# EAGLE design Mbus (EAGLE 9.6.2)
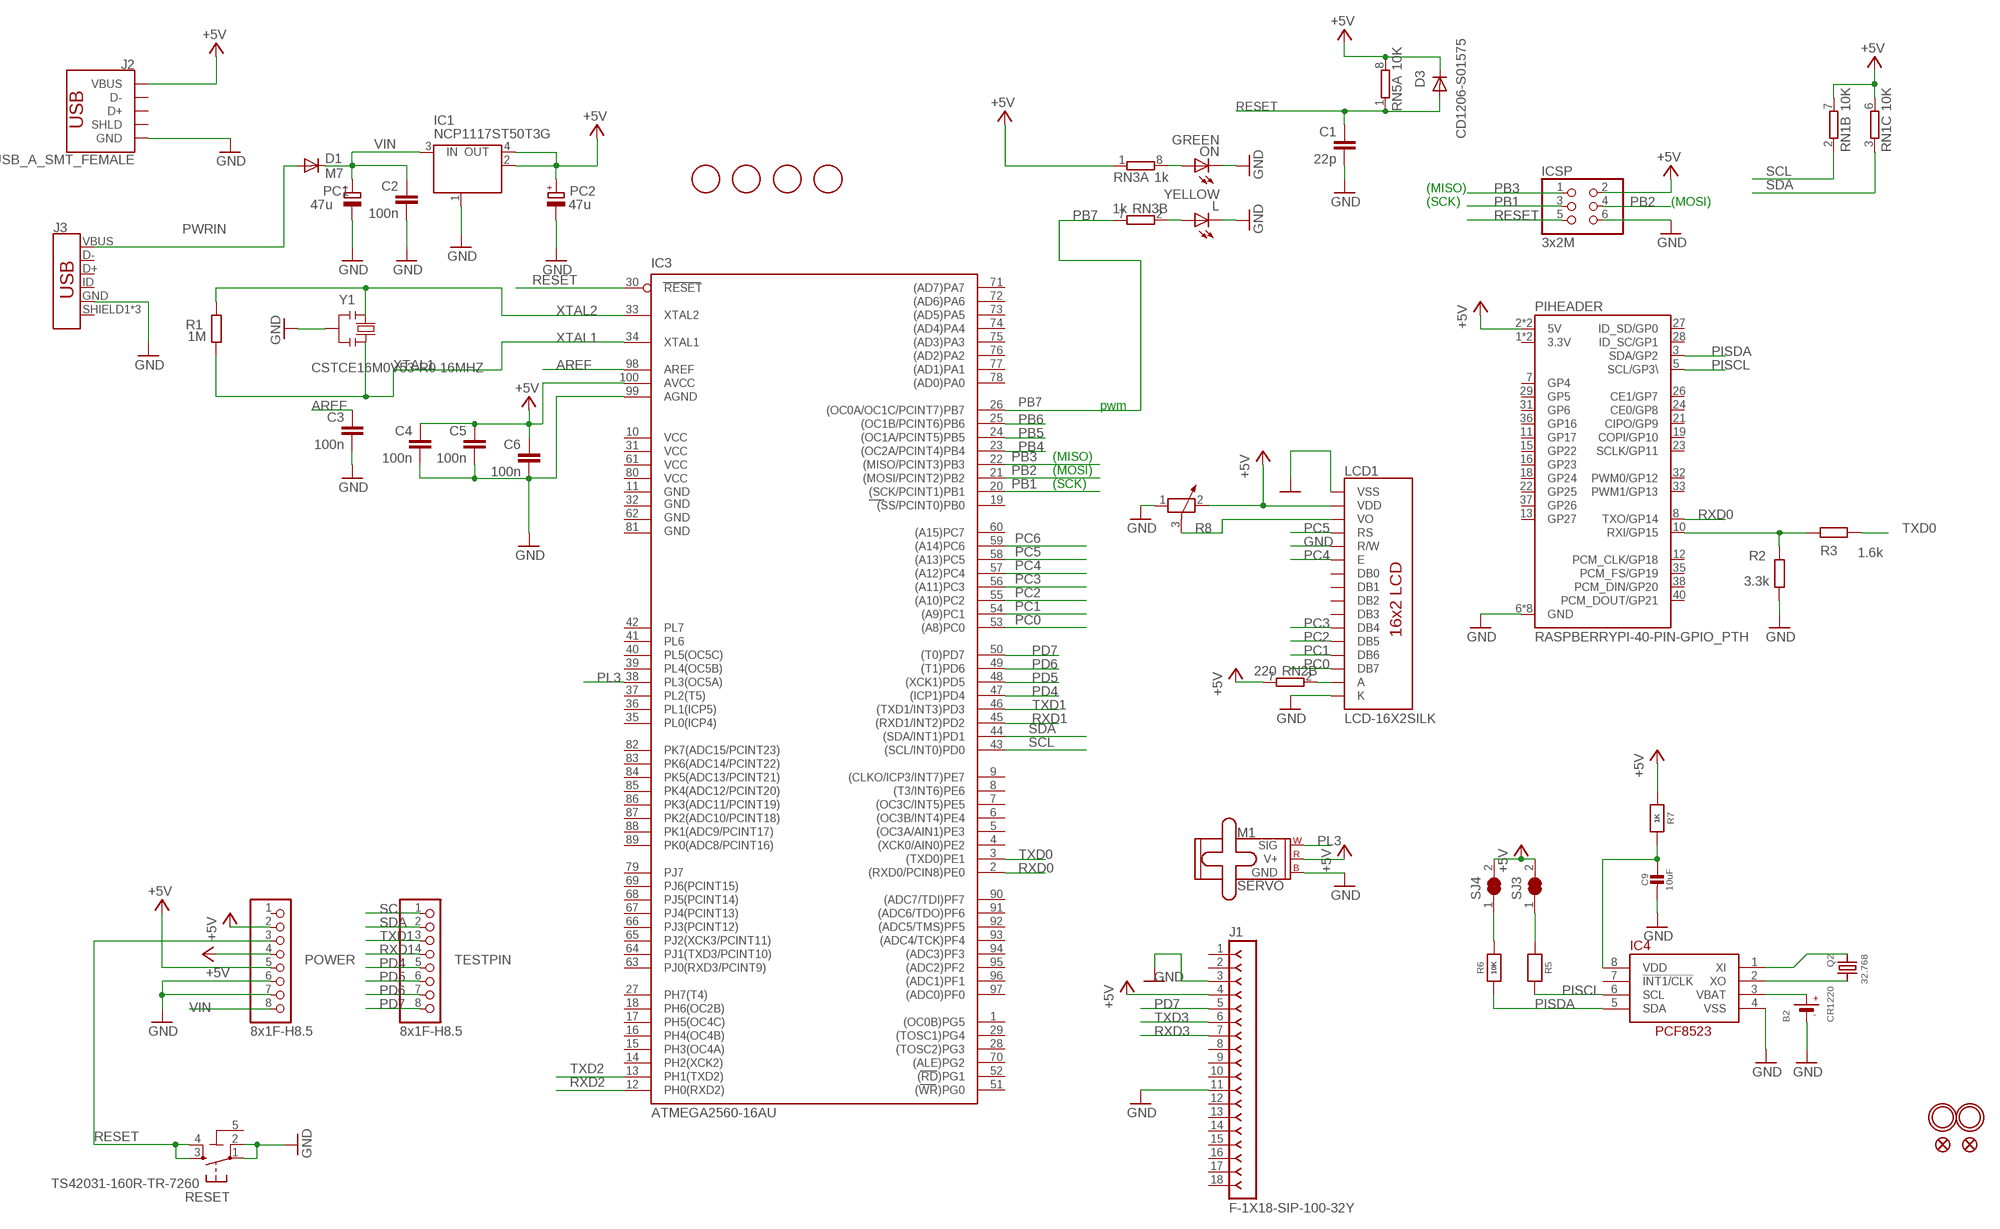
[diagram p0: schematic, sheet 1]

## Parts
B2  CR1220  BATTERYCR1220_SMT  [CR1220]
C1  22p  C-EU0603-RND  [C0603-ROUND]
C2  100n  C-EU0603-RND  [C0603-ROUND]
C3  100n  C-EU0603-RND  [C0603-ROUND]
C4  100n  C-EU0603-RND  [C0603-ROUND]
C5  100n  C-EU0603-RND  [C0603-ROUND]
C6  100n  C-EU0603-RND  [C0603-ROUND]
C9  10uF  CAP_CERAMIC0805-NOOUTLINE  [0805-NO]
D1  M7  DIODE-SMB  [SMB]
D3  CD1206-S01575  DIODE-MINIMELF  [MINIMELF]
FD1  FIDUCIALMOUNT  [FIDUCIA-MOUNT]
FD2  FIDUCIALMOUNT  [FIDUCIA-MOUNT]
FD3  FIDUCIALMOUNT  [FIDUCIA-MOUNT]
FD4  FIDUCIALMOUNT  [FIDUCIA-MOUNT]
FID3  FIDUCIAL""  [FIDUCIAL_1MM]
FID4  FIDUCIAL""  [FIDUCIAL_1MM]
IC1  NCP1117ST50T3G  MC33269ST-3.3T3  [SOT223]
IC3  ATMEGA2560-16AU  ATMEGA25602560-16AU  [TQFP100]
IC4  RTC_PCF8523T  [SOIC8_150MIL]
ICSP  3x2M  PINHD-2X3  [2X03]
J1  F-1X18-SIP-100-32Y  [SIP-100-18-32Y]
J2  USB_A_SMT_FEMALE  [USB-A-S-SILK-FEMALE]
J3  USB_MICRO-B_FEMALE-SMT  [USB-B-MICRO-SMD]
L  YELLOW  LEDCHIP-LED0805  [CHIP-LED0805]
LCD1  LCD-16X2SILK  [LCD-16X2]
M1  SERVO  [1X03]
ON  GREEN  LEDCHIP-LED0805  [CHIP-LED0805]
PC1  47u  CPOL-EUD  [PANASONIC_D]
PC2  47u  CPOL-EUD  [PANASONIC_D]
PIHEADER  RASPBERRYPI-40-PIN-GPIO_PTH  [2X20_SHROUDED]
POWER  8x1F-H8.5  PINHD-1X8  [1X08]
Q2  32.768  CRYSTAL8.0X3.8  [CRYSTAL_8X3.8]
R1  1M  R-EU_R0603  [R0603-ROUND]
R2  3.3k  R-EU_R0603  [R0603-ROUND]
R3  1.6k  R-EU_R0603  [R0603-ROUND]
R5  10K  RESISTOR0805_NOOUTLINE  [0805-NO]
R6  10K  RESISTOR0805_NOOUTLINE  [0805-NO]
R7  1K  RESISTOR0805_NOOUTLINE  [0805-NO]
R8  POTENTIOMETER_PT-10  [PT-10]
RESET  TS42031-160R-TR-7260  TS42  [TS42]
RN1  10K  4R-NCAT16  [CAT16]
RN2  220  4R-NCAY16  [CAY16]
RN3  1k  4R-NCAY16  [CAY16]
RN5  10K  4R-NCAT16  [CAT16]
SJ3  SOLDERJUMPER_CLOSED  [SOLDERJUMPER_CLOSEDWIRE]
SJ4  SOLDERJUMPER_CLOSED  [SOLDERJUMPER_CLOSEDWIRE]
TESTPIN  8x1F-H8.5  PINHD-1X8  [1X08]
U$2  MOUNTINGHOLE2.0  [MOUNTINGHOLE_2.0_PLATED]
U$3  MOUNTINGHOLE2.0  [MOUNTINGHOLE_2.0_PLATED]
Y1  CSTCE16M0V53-R0 16MHZ  RESONATORMU  [RESONATOR]

## Nets
+5V [power usb]: C4.1 C5.1 C6.1 D3.C IC1.2(OUT) IC1.4(OUT) IC3.100(AVCC) ICSP.2 J1.4 J2.VBUS LCD1.2(VDD) M1.2(V+) PC2.+ PIHEADER.2(5V) PIHEADER.4(5V) POWER.2 POWER.4 POWER.5 R7.1 R8.2 RN1.6 RN1.7 RN2.7 RN3.1 RN5.8 SJ3.2 SJ4.2
AREF: C3.1 IC3.98(AREF)
GND [gnd]: B2.- C1.2 C2.2 C3.2 C4.2 C5.2 C6.2 C9.2 IC1.1(GND/ADJ) IC3.99(AGND) IC4.4(VSS) ICSP.6 J1.3 J1.11 J2.GND J3.GND L.C LCD1.1(VSS) LCD1.5(R/W) LCD1.16(K) M1.3(GND) ON.C PC1.- PC2.- PIHEADER.6(GND) PIHEADER.9(GND) PIHEADER.14(GND) PIHEADER.20(GND) PIHEADER.25(GND) PIHEADER.30(GND) PIHEADER.34(GND) PIHEADER.39(GND) POWER.6 POWER.7 R2.1 R8.1 RESET.1 RESET.2 Y1.2
N$2: L.A RN3.2
N$3: ON.A RN3.8
N$6: IC4.1(XI) Q2.P$1
N$7: IC4.2(XO) Q2.P$4
N$8: R5.1 SJ3.1
N$9: R6.2 SJ4.1
N$10: C9.1 IC4.8(VDD) R7.2
N$11: LCD1.15(A) RN2.2
N$22: LCD1.3(VO) R8.3
PB1: IC3.20((SCK/PCINT1)PB1) ICSP.3
PB2: IC3.21((MOSI/PCINT2)PB2) ICSP.4
PB3: IC3.22((MISO/PCINT3)PB3) ICSP.1
PB4: IC3.23((OC2A/PCINT4)PB4)
PB5: IC3.24((OC1A/PCINT5)PB5)
PB6: IC3.25((OC1B/PCINT6)PB6)
PB7: IC3.26((OC0A/OC1C/PCINT7)PB7) RN3.7
PC0: IC3.53((A8)PC0) LCD1.14(DB7)
PC1: IC3.54((A9)PC1) LCD1.13(DB6)
PC2: IC3.55((A10)PC2) LCD1.12(DB5)
PC3: IC3.56((A11)PC3) LCD1.11(DB4)
PC4: IC3.57((A12)PC4) LCD1.6(E)
PC5: IC3.58((A13)PC5) LCD1.4(RS)
PC6: IC3.59((A14)PC6)
PD4: IC3.47((ICP1)PD4) TESTPIN.5
PD5: IC3.48((XCK1)PD5) TESTPIN.6
PD6: IC3.49((T1)PD6) TESTPIN.7
PD7: IC3.50((T0)PD7) J1.5 TESTPIN.8
PISCL: IC4.6(SCL) PIHEADER.5(SCL/GP3\) R5.2
PISDA: IC4.5(SDA) PIHEADER.3(SDA/GP2) R6.1
PL3: IC3.38(PL3(OC5A)) M1.1(SIG)
PWRIN [power]: D1.A J3.VBUS
RESET: C1.1 D3.A IC3.30(RESET) ICSP.5 POWER.3 RESET.3 RESET.4 RN5.1
RXD0: IC3.2((RXD0/PCIN8)PE0) PIHEADER.8(TXO/GP14)
RXD1: IC3.45((RXD1/INT2)PD2) TESTPIN.4
RXD2: IC3.12(PH0(RXD2))
RXD3: J1.7
SCL: IC3.43((SCL/INT0)PD0) RN1.2 TESTPIN.1
SDA: IC3.44((SDA/INT1)PD1) RN1.3 TESTPIN.2
TXD0: IC3.3((TXD0)PE1) R3.1
TXD1: IC3.46((TXD1/INT3)PD3) TESTPIN.3
TXD2: IC3.13(PH1(TXD2)) PIHEADER.10(RXI/GP15) R2.2 R3.2
TXD3: J1.6
VBAT1: B2.+$1(+) IC4.3(VBAT)
VIN [power]: C2.1 D1.C IC1.3(IN) PC1.+ POWER.8
XTAL1: IC3.34(XTAL1) R1.1 Y1.3
XTAL2: IC3.33(XTAL2) R1.2 Y1.1
Unconnected: IC3.1((OC0B)PG5) IC3.4((XCK0/AIN0)PE2) IC3.5((OC3A/AIN1)PE3) IC3.6((OC3B/INT4)PE4) IC3.7((OC3C/INT5)PE5) IC3.8((T3/INT6)PE6) IC3.9((CLKO/ICP3/INT7)PE7) IC3.14(PH2(XCK2)) IC3.15(PH3(OC4A)) IC3.16(PH4(OC4B)) IC3.17(PH5(OC4C)) IC3.18(PH6(OC2B)) IC3.19((SS/PCINT0)PB0) IC3.27(PH7(T4)) IC3.28((TOSC2)PG3) IC3.29((TOSC1)PG4) IC3.35(PL0(ICP4)) IC3.36(PL1(ICP5)) IC3.37(PL2(T5)) IC3.39(PL4(OC5B)) IC3.40(PL5(OC5C)) IC3.41(PL6) IC3.42(PL7) IC3.51((WR)PG0) IC3.52((RD)PG1) IC3.60((A15)PC7) IC3.63(PJ0(RXD3/PCINT9)) IC3.64(PJ1(TXD3/PCINT10)) IC3.65(PJ2(XCK3/PCINT11)) IC3.66(PJ3(PCINT12)) IC3.67(PJ4(PCINT13)) IC3.68(PJ5(PCINT14)) IC3.69(PJ6(PCINT15)) IC3.70((ALE)PG2) IC3.71((AD7)PA7) IC3.72((AD6)PA6) IC3.73((AD5)PA5) IC3.74((AD4)PA4) IC3.75((AD3)PA3) IC3.76((AD2)PA2) IC3.77((AD1)PA1) IC3.78((AD0)PA0) IC3.79(PJ7) IC3.82(PK7(ADC15/PCINT23)) IC3.83(PK6(ADC14/PCINT22)) IC3.84(PK5(ADC13/PCINT21)) IC3.85(PK4(ADC12/PCINT20)) IC3.86(PK3(ADC11/PCINT19)) IC3.87(PK2(ADC10/PCINT18)) IC3.88(PK1(ADC9/PCINT17)) IC3.89(PK0(ADC8/PCINT16)) IC3.90((ADC7/TDI)PF7) IC3.91((ADC6/TDO)PF6) IC3.92((ADC5/TMS)PF5) IC3.93((ADC4/TCK)PF4) IC3.94((ADC3)PF3) IC3.95((ADC2)PF2) IC3.96((ADC1)PF1) IC3.97((ADC0)PF0) IC4.7(!INT1/CLK) J1.1 J1.2 J1.8 J1.9 J1.10 J1.12 J1.13 J1.14 J1.15 J1.16 J1.17 J1.18 J2.D+ J2.D- J2.SHLD1(SHLD) J2.SHLD2(SHLD) J3.D+ J3.D- J3.ID J3.SHIELD1(SHIELD) J3.SHIELD2(SHIELD) J3.SHIELD3(SHIELD) LCD1.7(DB0) LCD1.8(DB1) LCD1.9(DB2) LCD1.10(DB3) PIHEADER.7(GP4) PIHEADER.11(GP17) PIHEADER.12(PCM_CLK/GP18) PIHEADER.13(GP27) PIHEADER.15(GP22) PIHEADER.16(GP23) PIHEADER.18(GP24) PIHEADER.19(COPI/GP10) PIHEADER.21(CIPO/GP9) PIHEADER.22(GP25) PIHEADER.23(SCLK/GP11) PIHEADER.24(CE0/GP8) PIHEADER.26(CE1/GP7) PIHEADER.27(ID_SD/GP0) PIHEADER.28(ID_SC/GP1) PIHEADER.29(GP5) PIHEADER.31(GP6) PIHEADER.32(PWM0/GP12) PIHEADER.33(PWM1/GP13) PIHEADER.35(PCM_FS/GP19) PIHEADER.36(GP16) PIHEADER.37(GP26) PIHEADER.38(PCM_DIN/GP20) PIHEADER.40(PCM_DOUT/GP21) POWER.1 RN1.1 RN1.4 RN1.5 RN1.8 RN2.1 RN2.3 RN2.4 RN2.5 RN2.6 RN2.8 RN3.3 RN3.4 RN3.5 RN3.6 RN5.2 RN5.3 RN5.4 RN5.5 RN5.6 RN5.7

## Notes on the sheet
- (MISO)
- (SCK) | (MOSI)
- pwm
- (MISO)
- (MOSI)
- (SCK)

## Power pins joined to a net without a drawn wire
3.3V: PIHEADER.1(3.3V) PIHEADER.17(3.3V)
5-GND: RESET.5(5-GND)
GND: IC3.11(GND)
GND1: IC3.32(GND1)
GND2: IC3.62(GND2)
GND3: IC3.81(GND3)
VCC: IC3.10(VCC)
VCC1: IC3.31(VCC1)
VCC2: IC3.61(VCC2)
VCC3: IC3.80(VCC3)

## Library data of the parts
B2 = microbuilder:BATTERY: CR1220 SMT - Digikey: 3001K-ND CD2032 BAT-HLD-001 - Digikey: BAT-HLD-001-ND
C1-C6 = SmartPrj:C-EU: CAPACITOR, European symbol
C9 = microbuilder:CAP_CERAMIC: Ceramic Capacitors For new designs, use the packages preceded by an '_' character since they are more reliable: The following footprints should be used on most boards: _0402 - Standard footprint for regular board layouts _0603 - Standard footprint for regular board layouts _0805 - Standard footprint for regular board layouts _1206 - Standard footprint for regular board layouts For extremely tight-pitch boards where space is at a premium, the following 'micro-pitch' footprints can be used (smaller pads, no silkscreen outline, etc.): _0402MP - Micro-pitch footprint for very dense/compact boards _0603MP - Micro-pitch footprint for very dense/compact boards _0805MP - Micro-pitch footprint for very dense/compact boards _1206MP - Micro-pitch footprint for very dense/compact boards
D1 D3 = diode:DIODE-: DIODE
FD1-FD4 = SmartPrj:FIDUCIALMOUNT
FID3 FID4 = microbuilder:FIDUCIAL: Fiducial Alignment Points Various fiducial points for machine vision alignment.; BOM: EXCLUDE
IC1 = linear:MC33269ST*: Adjustable Output Low Dropout Voltage Regulator 800 mA Source: http://www.onsemi.com/pub/Collateral/MC33269-D.PDF
IC3 = SmartPrj:ATMEGA2560: MICROCONTROLLER 64/128/256 Kbytes FLASH 4 Kbytes EEPROM 8 Kbytes SRAM 86 General Purpose I/O pins 12-channels16-bit PWM 4 x Serial USARTs 16-channels 10-bit A/D
IC4 = microbuilder:RTC_PCF8523
ICSP = SmartPrj:PINHD-2X3: PIN HEADER
J1 = con-headers-jp:F-1X18-: FEMALE HEADER
J2 = SparkFun-Connectors:USB_A: USB-A Connector Male and female variants, as well as PTH and SMT variants SparkFun Products: SparkFun XBee Explorer Dongle <https://www.sparkfun.com/products/11697> PTH Male SparkFun MicroView-USB Programmer <https://www.sparkfun.com/products/12924> SMT Male SparkFun USB Type A Female Breakout <https://www.sparkfun.com/products/12700> SMT Female; PROD_ID: CONN-09520; SF_ID: PRT-09011
J3 = SparkFun-Connectors:USB_MICRO-B: USB Type Micro-B Connector Male/female and PTH/SMT variants SparkFun Products: SparkFun microB USB Breakout <https://www.sparkfun.com/products/12035> SparkFun USB microB Plug Breakout <https://www.sparkfun.com/products/10031> SparkFun ESP8266 Thing <https://www.sparkfun.com/products/13231>; PROD_ID: CONN-11752
L ON = led:LED: LED OSRAM: - CHIPLED LG R971, LG N971, LY N971, LG Q971, LY Q971, LO R971, LY R971 LH N974, LH R974 LS Q976, LO Q976, LY Q976 LO Q996 - Hyper CHIPLED LW Q18S LB Q993, LB Q99A, LB R99A - SideLED LS A670, LO A670, LY A670, LG A670, LP A670 LB A673, LV A673, LT A673, LW A673 LH A674 LY A675 LS A676, LA A676, LO A676, LY A676, LW A676 LS A679, LY A679, LG A679 - Hyper Micro SIDELED® LS Y876, LA Y876, LO Y876, LY Y876 LT Y87S - SmartLED LW L88C, LW L88S LB L89C, LB L89S, LG L890 LS L89K, LO L89K, LY L89K LS L896, LA L896, LO L896, LY L896 - TOPLED LS T670, LO T670, LY T670, LG T670, LP T670 LSG T670, LSP T670, LSY T670, LOP T670, LYG T670 LG T671, LOG T671, LSG T671 LB T673, LV T673, LT T673, LW T673 LH T674 LS T676, LA T676, LO T676, LY T676, LB T676, LH T676, LSB T676, LW T676 LB T67C, LV T67C, LT T67C, LS T67K, LO T67K, LY T67K, LW E67C LS E67B, LA E67B, LO E67B, LY E67B, LB E67C, LV E67C, LT E67C LW T67C LS T679, LY T679, LG T679 LS T770, LO T770, LY T770, LG T770, LP T770 LB T773, LV T773, LT T773, LW T773 LH T774 LS E675, LA E675, LY E675, LS T675 LS T776, LA T776, LO T776, LY T776, LB T776 LHGB T686 LT T68C, LB T68C - Hyper Mini TOPLED® LB M676 - Mini TOPLED Santana® LG M470 LS M47K, LO M47K, LY M47K Source: http://www.osram.convergy.de LUXEON: - LUMILED® LXK2-PW12-R00, LXK2-PW12-S00, LXK2-PW14-U00, LXK2-PW14-V00 LXK2-PM12-R00, LXK2-PM12-S00, LXK2-PM14-U00 LXK2-PE12-Q00, LXK2-PE12-R00, LXK2-PE12-S00, LXK2-PE14-T00, LXK2-PE14-U00 LXK2-PB12-K00, LXK2-PB12-L00, LXK2-PB12-M00, LXK2-PB14-N00, LXK2-PB14-P00, LXK2-PB14-Q00 LXK2-PR12-L00, LXK2-PR12-M00, LXK2-PR14-Q00, LXK2-PR14-R00 LXK2-PD12-Q00, LXK2-PD12-R00, LXK2-PD12-S00 LXK2-PH12-R00, LXK2-PH12-S00 LXK2-PL12-P00, LXK2-PL12-Q00, LXK2-PL12-R00 Source: www.luxeon.com KINGBRIGHT: KA-3528ASYC Source: www.kingbright.com
LCD1 = SparkFun-Displays:LCD-16X2: Standard text-only 16x2 parallel input LCD Basic 16 character by 2 line display. Typically utilizes the extremely common HD44780 parallel interface chipset SparkFun Products: Basic 16x2 Green <https://www.sparkfun.com/products/255> Basic 8x2 Green <https://www.sparkfun.com/products/11122>; PROD_ID: LCD-12633; SF_ID: LCD-00255
M1 = SparkFun-Electromechanical:SERVO: Servo Motor 3-pin connector for a standard servo motor (voltage supply, ground, and control signal.) SparkFun Products Servo - Generic (Sub-Micro Size) <https://www.sparkfun.com/products/9065> (ROB-09065) Servo - Generic High Torque Continuous Rotation (Standard Size) <https://www.sparkfun.com/products/9347> (ROB-09347) Servo - Generic High Torque (Standard Size) <https://www.sparkfun.com/products/11965> (ROB-11965)
PC1 PC2 = rcl:CPOL-EU: POLARIZED CAPACITOR, European symbol
PIHEADER = SparkFun-Connectors:RASPBERRYPI-40-PIN-GPIO: Raspberry Pi GPIO Header 2x20 pin connector, as found on B, B+, A+ models. Both shrouded PTH and SMT versions available. SparkFun Products: GPIO Shrouded Header <https://www.sparkfun.com/products/13054>- PTH SparkFun Pi Wedge (Preassembled) <https://www.sparkfun.com/products/13717>; PROD_ID: CONN-12263; SF_ID: PRT-13054
POWER TESTPIN = SmartPrj:PINHD-1X8: PIN HEADER
Q2 = microbuilder:CRYSTAL: Crystals HC49UP - Surface Mount Crystal 4.0MHz 18pF +/-30ppm Surface Mount Crystal [Digikey: 535-9857-1-ND] 12.0 MHz Surface Mount Crystal [Digikey: 535-9869-6-ND] 25.0 MHz Surface Mount Crystal [Digikey: 535-9078-1-ND] 2.5 x 2.0mm - MEMs SMT Crystal 16.0 MHz 10pF 20ppm 2.5 x 2.0mm Crystal [Digikey -40-85°C: 535-10923-1-ND] 3.2 x 2.5mm - MEMs SMT Crystal 12.0 MHz 8pF 15ppm 3.2 x 2.5mm Crystal [Digikey: -10-70°C: 644-1047-1-ND -40-125°C: 644-1128-1-ND] 40~85°C cheaper: 644-1173-6-ND 16.0 MHz 8pF 15ppm 3.2 x 2.5mm Crystal [Digikey: -10-70°C: 644-1049-1-ND -40-125°C: 644-1129-2-ND]-40~85°C cheaper: 644-1175-6-ND 16.0 MHz 10pF 10ppm 3.2 x 2.5mm Crystal [Digikey: 644-1100-1-ND] 27.12 MHz 18pF 30ppm 3.2 x 2.5mm Crystal [Digikey: 887-1424-1-ND] 27.12MHz 10pF 10ppm 3.2 x 2.5mm Crystal [Digikey: 887-1329-1-ND] 4.9 x 1.8mm - MEMs SMT Crystal 32.768 KHz 12.5pF 20ppm 4.9 x 1.8mm Crystal [Digikey: SE2415CT-ND] 8.0 x 3.8mm - Surface Mount Crystal 32.768kHz 12.5pF 20ppm -40°C-85°C [Digikey: 535-9166-2-ND] Cylinder 32.768KHz Cylinder Crystal (2x6mm body) [Ex. Digikey: 300-8341-2-ND]
R1-R3 = SmartPrj:R-EU_: RESISTOR, European symbol
R5-R7 = microbuilder:RESISTOR: Resistors For new designs, use the packages preceded by an '_' character since they are more reliable: The following footprints should be used on most boards: _0402 - Standard footprint for regular board layouts _0603 - Standard footprint for regular board layouts _0805 - Standard footprint for regular board layouts _1206 - Standard footprint for regular board layouts For extremely tight-pitch boards where space is at a premium, the following 'micro-pitch' footprints can be used (smaller pads, no silkscreen outline, etc.): _0402MP - Micro-pitch footprint for very dense/compact boards _0603MP - Micro-pitch footprint for very dense/compact boards _0805MP - Micro-pitch footprint for very dense/compact boards _1206MP - Micro-pitch footprint for very dense/compact boards
R8 = rcl:POTENTIOMETER_: Potentiometer; SPICEMODEL: POT; SPICEPREFIX: X
RESET = SmartPrj:TS42: TS42 Dongnan Electronics Tact switch VDC 12V - 50mA
RN1-RN3 RN5 = resistor-dil:4R-N: Array Chip Resistor Source: RS Component / Phycomp
SJ3 SJ4 = microbuilder:SOLDERJUMPER_CLOSED: Solder Jumper - Closed These solder jumpers are closed by default CLOSEDWIRE - 10 mil trace between pads that can be cut and resoldered later CLOSEDPERM - 63 mil trace between pads for a permanent connection (used to 'bridge' two signals, a shameless hack for Eagle). Can double as a test point as well (no cream layer)
U$2 U$3 = microbuilder:MOUNTINGHOLE: Mounting Hole For #2 screws (0.086"/2.18mm width, 0.094"/2.4mm hole) use 2.5mm; BOM: EXCLUDE
Y1 = SmartPrj:RESONATOR

## Net classes
1 power: width 0.61 mm, drill 0.406 mm, clearance 0.203 mm
2 gnd: width 0.305 mm, drill 0.406 mm, clearance 0.203 mm
3 power usb: width 0.508 mm, drill 0.406 mm, clearance 0.203 mm

## Board
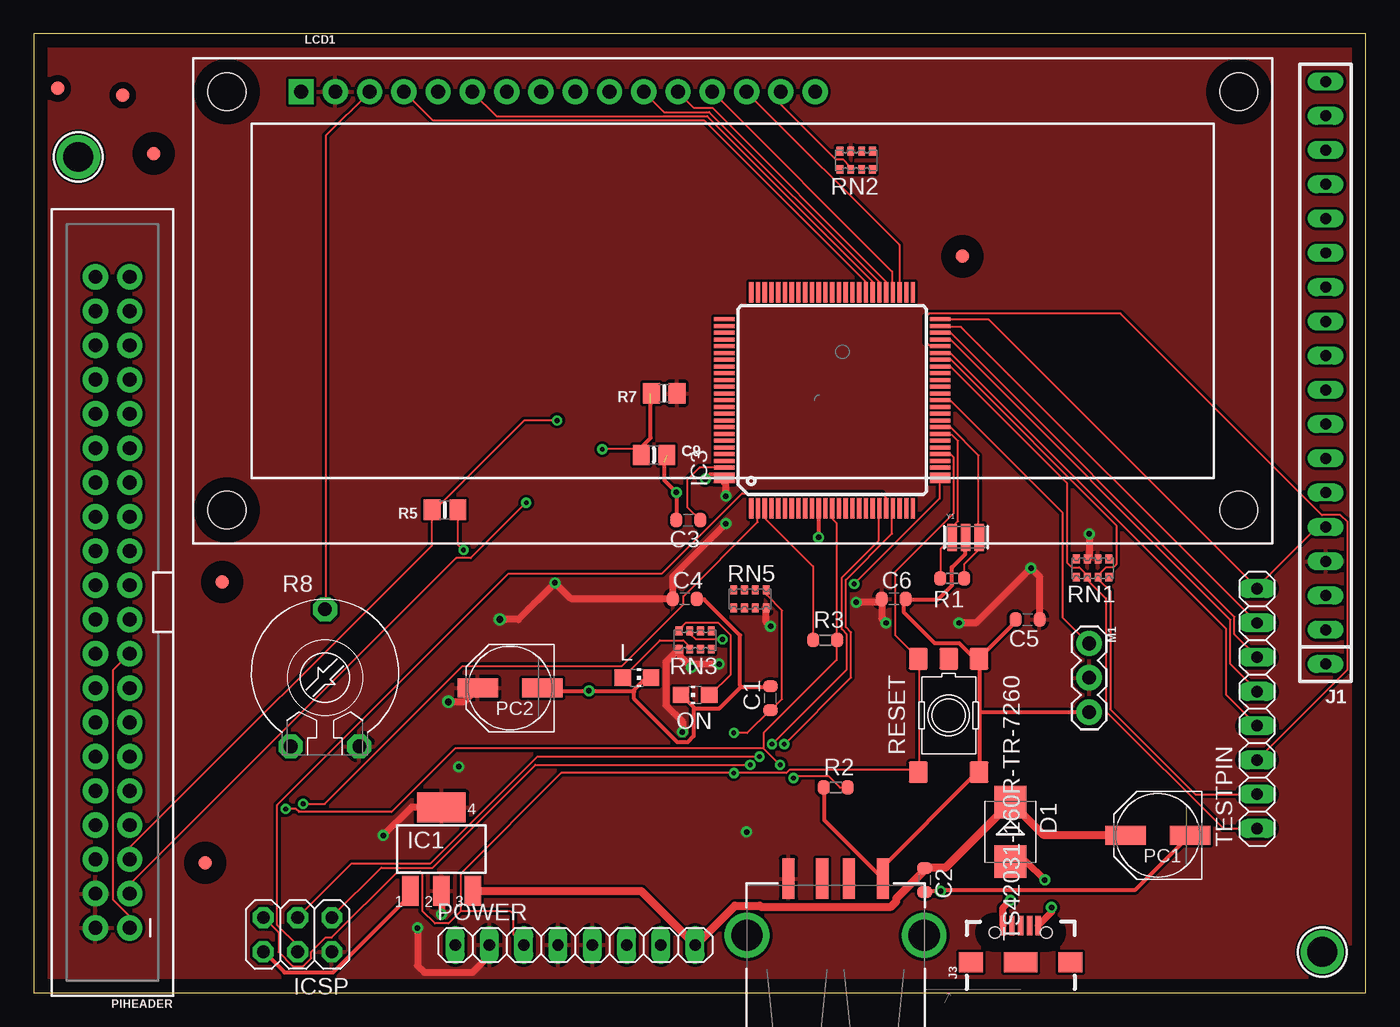
[diagram p1: board, top side]
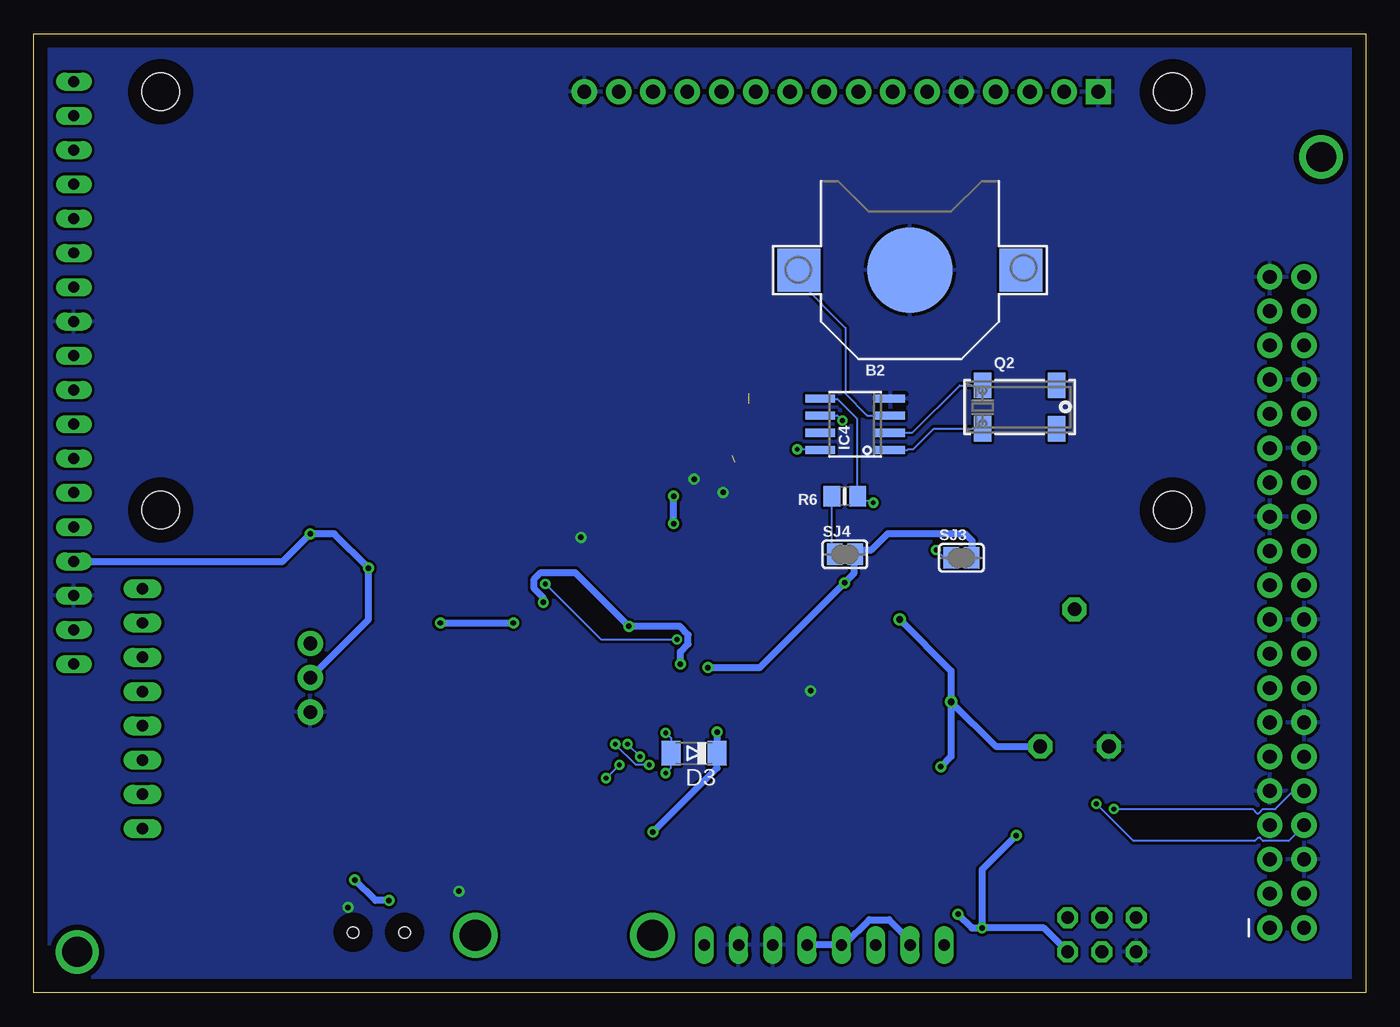
[diagram p2: board, bottom side, seen from below]

Size 98.73 x 71.11 mm. Coordinates in mm from the lower left corner, seen from the top.
Outline: 0,0 98.73,0 98.73,71.11 0,71.11 0,0
Copper layers (1*16): Top 0.035mm / dielectric 1.5mm / Bottom 0.035mm
Design rules "default *": minimum track width 6mil, minimum drill 0.35mm, track to track 0.002540625mm, track to pad 0.002540625mm, pad to pad 0.002540625mm, via to via 0.002540625mm, smd to smd 0.002540625mm, copper to edge 40mil, drill to drill 6mil, minimum pad ring 10mil, minimum via ring 8mil, stop-mask expansion 4mil, vias tented up to drill 0mil, thermal gap 10mil

### Footprints (pad centres in the part's own frame; a part is rotated, then mirrored left to right if it is on the bottom)
CR1220 = smd 3.2 x 3.2: +$1 -8.225,0; +$2 8.225,0 | smd 6.35 x 6.35: - 0,0
C0603-ROUND = smd 0.898 x 1.1: 1 -0.889,0; 2 0.889,0
0805-NO = smd 1.24 x 1.5: 1 -0.95,0; 2 0.95,0
SMB = smd 2.4 x 2.4: A 2.2,0; C -2.2,0
MINIMELF = smd 1.4 x 1.8: A 1.7,0; C -1.7,0
FIDUCIA-MOUNT = smd 1.016 x 1.016: P$1 0,0
FIDUCIAL_1MM = smd 1 x 1: 1 0,0
SOT223 = smd 1.219 x 2.235: 1 -2.311,-3.099; 2 0,-3.099; 3 2.311,-3.099 | smd 3.6 x 2.2: 4 0,3.099
TQFP100 = smd 1.5 x 0.3: 1 -8,6; 2 -8,5.5; 3 -8,5; 4 -8,4.5; 5 -8,4; 6 -8,3.5; 7 -8,3; 8 -8,2.5; 9 -8,2; 10 -8,1.5; 11 -8,1; 12 -8,0.5; 13 -8,0; 14 -8,-0.5; 15 -8,-1; 16 -8,-1.5; 17 -8,-2; 18 -8,-2.5; 19 -8,-3; 20 -8,-3.5; 21 -8,-4; 22 -8,-4.5; 23 -8,-5; 24 -8,-5.5; 25 -8,-6; 51 8,-6; 52 8,-5.5; 53 8,-5; 54 8,-4.5; 55 8,-4; 56 8,-3.5; 57 8,-3; 58 8,-2.5; 59 8,-2; 60 8,-1.5; 61 8,-1; 62 8,-0.5; 63 8,0; 64 8,0.5; 65 8,1; 66 8,1.5; 67 8,2; 68 8,2.5; 69 8,3; 70 8,3.5; 71 8,4; 72 8,4.5; 73 8,5; 74 8,5.5; 75 8,6 | smd 0.3 x 1.5: 26 -6,-8; 27 -5.5,-8; 28 -5,-8; 29 -4.5,-8; 30 -4,-8; 31 -3.5,-8; 32 -3,-8; 33 -2.5,-8; 34 -2,-8; 35 -1.5,-8; 36 -1,-8; 37 -0.5,-8; 38 0,-8; 39 0.5,-8; 40 1,-8; 41 1.5,-8; 42 2,-8; 43 2.5,-8; 44 3,-8; 45 3.5,-8; 46 4,-8; 47 4.5,-8; 48 5,-8; 49 5.5,-8; 50 6,-8; 76 6,8; 77 5.5,8; 78 5,8; 79 4.5,8; 80 4,8; 81 3.5,8; 82 3,8; 83 2.5,8; 84 2,8; 85 1.5,8; 86 1,8; 87 0.5,8; 88 0,8; 89 -0.5,8; 90 -1,8; 91 -1.5,8; 92 -2,8; 93 -2.5,8; 94 -3,8; 95 -3.5,8; 96 -4,8; 97 -4.5,8; 98 -5,8; 99 -5.5,8; 100 -6,8
SOIC8_150MIL = smd 0.6 x 2.2: 1 -1.905,-2.6; 2 -0.635,-2.6; 3 0.635,-2.6; 4 1.905,-2.6; 5 1.905,2.6; 6 0.635,2.6; 7 -0.635,2.6; 8 -1.905,2.6
2X03 = drill 0.95 pad 1.55 octagon: 1 -2.54,-1.27; 2 -2.54,1.27; 3 0,-1.27; 4 0,1.27; 5 2.54,-1.27; 6 2.54,1.27
SIP-100-18-32Y = drill 0.813 long: 1 -21.59,0; 2 -19.05,0; 3 -16.51,0; 4 -13.97,0; 5 -11.43,0; 6 -8.89,0; 7 -6.35,0; 8 -3.81,0; 9 -1.27,0; 10 1.27,0; 11 3.81,0; 12 6.35,0; 13 8.89,0; 14 11.43,0; 15 13.97,0; 16 16.51,0; 17 19.05,0; 18 21.59,0
USB-A-S-SILK-FEMALE = smd 3 x 0.9: D+ 7.212,-1; D- 7.212,1; GND 7.212,-3.5; VBUS 7.212,3.5 | drill 2.311: SHLD1 3,-6.566; SHLD2 3,6.566
USB-B-MICRO-SMD = smd 1.45 x 0.4: D+ 2.725,0; D- 2.725,0.65; GND 2.725,-1.3; ID 2.725,-0.65; VBUS 2.725,1.3 | smd 1.5 x 1.8: SHIELD1 0,3.685; SHIELD2 0,-3.685 | smd 1.5 x 2.5: SHIELD3 0,0 | hole 0.85: 2.2,1.9; 2.2,-1.9
CHIP-LED0805 = smd 1.2 x 1.2: A 0,-1.05; C 0,1.05
LCD-16X2 = drill 1.016 pad 1.88 square: 1 -32,15.5 | drill 1.016 pad 1.88: 2 -29.46,15.5; 3 -26.92,15.5; 4 -24.38,15.5; 5 -21.84,15.5; 6 -19.3,15.5; 7 -16.76,15.5; 8 -14.22,15.5; 9 -11.68,15.5; 10 -9.14,15.5; 11 -6.6,15.5; 12 -4.06,15.5; 13 -1.52,15.5; 14 1.02,15.5; 15 3.56,15.5; 16 6.1,15.5 | hole 2.8: -37.5,15.5; -37.5,-15.5; 37.5,15.5; 37.5,-15.5
1X03 = drill 1.016 pad 1.88: 1 0,0; 2 2.54,0; 3 5.08,0
PANASONIC_D = smd 3 x 1.4: + 2.4,0; - -2.4,0
2X20_SHROUDED = drill 1.016 pad 1.88: 1 -1.27,24.13; 2 1.27,24.13; 3 -1.27,21.59; 4 1.27,21.59; 5 -1.27,19.05; 6 1.27,19.05; 7 -1.27,16.51; 8 1.27,16.51; 9 -1.27,13.97; 10 1.27,13.97; 11 -1.27,11.43; 12 1.27,11.43; 13 -1.27,8.89; 14 1.27,8.89; 15 -1.27,6.35; 16 1.27,6.35; 17 -1.27,3.81; 18 1.27,3.81; 19 -1.27,1.27; 20 1.27,1.27; 21 -1.27,-1.27; 22 1.27,-1.27; 23 -1.27,-3.81; 24 1.27,-3.81; 25 -1.27,-6.35; 26 1.27,-6.35; 27 -1.27,-8.89; 28 1.27,-8.89; 29 -1.27,-11.43; 30 1.27,-11.43; 31 -1.27,-13.97; 32 1.27,-13.97; 33 -1.27,-16.51; 34 1.27,-16.51; 35 -1.27,-19.05; 36 1.27,-19.05; 37 -1.27,-21.59; 38 1.27,-21.59; 39 -1.27,-24.13; 40 1.27,-24.13
1X08 = drill 0.85 pad 1.422 long: 1 -8.89,0; 2 -6.35,0; 3 -3.81,0; 4 -1.27,0; 5 1.27,0; 6 3.81,0; 7 6.35,0; 8 8.89,0
CRYSTAL_8X3.8 = smd 1.3 x 1.9: P$1 -2.75,-1.6; P$2 2.75,-1.6; P$3 2.75,1.6; P$4 -2.75,1.6
R0603-ROUND = smd 0.898 x 1.1: 1 -0.889,0; 2 0.889,0
PT-10 = drill 1.016 pad 1.778 octagon: 1 -2.54,-5.08; 2 2.54,-5.08; 3 0,5.08
TS42 = smd 1.6 x 1.4: 1 -4.2,2.25; 2 4.2,2.25; 3 -4.2,-2.25; 4 4.2,-2.25; 5 -4.2,0
CAT16 = smd 0.5 x 0.65: 1 -1.2,-0.675; 2 -0.4,-0.675; 3 0.4,-0.675; 4 1.2,-0.675; 5 1.2,0.675; 6 0.4,0.675; 7 -0.4,0.675; 8 -1.2,0.675
CAY16 = smd 0.5 x 0.65: 1 -1.2,-0.675; 2 -0.4,-0.675; 3 0.4,-0.675; 4 1.2,-0.675; 5 1.2,0.675; 6 0.4,0.675; 7 -0.4,0.675; 8 -1.2,0.675
SOLDERJUMPER_CLOSEDWIRE = smd 1.168 x 1.6: 1 -0.762,0; 2 0.762,0 | smd 0.635 x 0.203: WIRE 0,0
MOUNTINGHOLE_2.0_PLATED = drill 2.2 pad 3: P$1 0,0
RESONATOR = smd 0.7 x 2: 1 -1,0; 2 0,0; 3 1,0

### Placement (x,y rotation side)
B2  33.78,53.59 0 bottom
C1  54.61,21.84 90 top
C2  66.04,8.38 270 top
C3  48.51,35.05 180 top
C4  48.26,29.21 0 top
C5  73.66,27.69 180 top
C6  63.75,29.21 0 top
C9  45.97,39.88 0 top
D1  72.39,11.94 270 top
D3  49.78,17.78 180 bottom
FD1  68.83,54.61 0 top
FD2  13.97,30.48 0 top
FD3  12.7,9.65 0 top
FD4  8.89,62.23 0 top
FID3  6.6,66.55 0 top
FID4  1.78,67.06 0 top
IC1  30.23,10.67 0 top
IC3  59.18,43.94 90 top
IC4  37.85,42.16 90 bottom
ICSP  19.56,4.32 180 top
J1  95.76,45.97 90 top
J2  59.44,1.27 90 top
J3  73.15,2.29 90 top
L  44.7,23.37 270 top
LCD1  51.82,51.31 0 top
M1  78.23,25.91 270 top
ON  49.02,22.1 90 top
PC1  83.31,11.68 180 top
PC2  35.31,22.61 180 top
PIHEADER  5.84,28.96 180 top
POWER  40.13,3.56 0 top
Q2  25.65,43.43 0 bottom
R1  68.07,30.73 180 top
R2  59.44,15.24 0 top
R3  58.67,26.16 0 top
R5  30.48,35.81 180 top
R6  38.61,36.83 180 bottom
R7  46.74,44.45 180 top
R8  21.59,23.37 0 top
RESET  67.82,20.57 270 top
RN1  78.49,31.5 0 top
RN2  60.96,61.72 0 top
RN3  49.02,26.16 0 top
RN5  53.09,29.21 180 top
SJ3  29.97,32.26 0 bottom
SJ4  38.61,32.51 0 bottom
TESTPIN  90.68,21.08 90 top
U$2  95.5,3.05 0 top
U$3  3.3,61.98 0 top
Y1  69.09,33.78 0 top

### Tracks (layer width: path | path; a pad name or v marks a point on that pad's centre or on a via)
3.3V
  Top 0.152: PIHEADER.1 7.09,4.88 7.09,5.71 5.87,6.93 5.87,23.93 7.09,25.15 PIHEADER.17
+5V  (via drill 0.41, 0.51)
  Top 0.508: v48.08,19.36 48.08,20.12 46.86,21.34 46.86,24.54 47.78,25.45 RN3.1 47.91,25.39 47.91,24.97 48.18,24.7 48.19,24.7 v48.77,24.13 49.02,24.38 v50.8,24.38 | PC2.+ 31.89,21.59 v30.73,21.59 | v34.54,27.69 35.92,27.69 v38.63,30.4 39.78,29.26 47.32,29.26 C4.1 47.37,30.86 v51.31,34.8 | v78.23,34.04 78.23,32.32 RN1.7 | C5.1 74.55,30.86 v73.91,31.5 69.85,27.43 v68.58,27.43 | v60.96,28.96 62.61,28.96 C6.1 62.87,27.74 v63.17,27.43 | v54.61,27.18 54.29,27.5 RN5.8 | v28.45,4.83 28.45,2.03 28.96,1.52 32.51,1.52 33.78,2.79 POWER.2 | IC1.2 v30.23,5.84 | IC1.4 27.99,13.77 v25.91,11.68 | v51.31,36.83 51.31,37.71 51.18,37.83
  Bottom 0.508: v48.08,19.36 48.08,17.83 D3.C 48.08,16.69 v52.83,11.94 | SJ3.2 29.18,32.31 29.18,33.53 29.72,34.06 35.43,34.06 36.65,32.84 37.49,32.84 37.8,32.54 SJ4.2 37.72,32.31 37.95,32.08 37.95,31.09 v38.63,30.4 44.91,24.13 v48.77,24.13 | v30.73,21.59 27.43,18.29 R8.2 | v34.54,27.69 30.73,23.88 v30.73,21.59 | v30.73,21.59 30.73,17.53 v31.5,16.76 | ICSP.2 23.88,4.83 v28.45,4.83 | POWER.5 38.69,3.56 36.81,5.44 35.33,5.44 33.78,3.89 POWER.2 | J1.4 80.26,32 v78.23,34.04 76.45,34.04 v73.91,31.5 73.91,27.69 M1.2 | v60.96,28.96 60.96,29.3 61.64,29.98 61.64,30.67 61.15,31.16 58.59,31.16 v54.61,27.18 50.84,27.18 50.22,26.56 50.22,25.87 50.8,25.29 v50.8,24.38 | v68.58,27.43 v63.17,27.43 | v51.31,34.8 v51.31,36.83 | v30.23,5.84 29.21,4.83 v28.45,4.83 | v25.91,11.68 28.45,9.14 v28.45,4.83
  pour Top: -1.02,71.63 99.57,71.63 99.57,68.83 99.57,-1.27 98.81,-1.27 -1.02,-1.27
AREF
  Top 0.152: C3.1 48.44,36.02 48.44,38.02 49.35,38.94 51.13,38.94 IC3.98
GND  (via drill 0.41)  (1 unrouted)
  Top 0.305: R2.1 58.6,15.24 58.6,12.8 62.87,8.53 J2.GND 62.56,8.99 69.95,16.38 RESET.2 70.1,16.38 70.1,20.8 | C5.2 72.77,27.51 70.1,24.84 RESET.1 | 69.95,24.84 RESET.1 | 70.1,20.8 70.1,24.69 RESET.1 | Y1.2 69.04,33.76 69.04,32.54 68.05,31.55 68.07,31.52 68.07,30.23 67.03,29.18 64.69,29.18 C6.2 64.52,29.08 64.52,28.19 66.78,25.93 68.6,25.93 69.76,24.77 RESET.1 | 44.42,22.4 45.34,23.32 45.72,23.32 L.C | 44.42,22.4 v41.15,22.4 37.87,22.4 37.72,22.55 PC2.- | 52.43,22.71 54.56,22.71 C1.2 | 52.43,22.71 50.83,21.11 49,21.11 | 49,21.11 48.01,22.1 ON.C | C4.2 49.15,29.18 49.68,29.18 52.35,26.52 52.35,22.78 52.43,22.71 | 44.42,22.4 44.5,22.33 44.5,21.79 47.7,18.59 48.46,18.59 48.92,19.05 48.92,21.03 49,21.11 | C3.2 v47.62,37.11 46.74,38 46.74,39.37 | 46.94,39.85 C9.2 | C2.2 66.06,7.54 v67.21,7.54 67.28,7.62 81.61,7.62 85.65,11.66 PC1.- | IC1.1 27.89,7.54 27.89,7.24 22.17,1.52 18.59,1.52 17.07,3.05 ICSP.6 | 70.1,20.8 78.18,20.8 M1.3 | IC3.99 50.13,38.44 v49.78,38.1 | IC3.11 58.18,33.8
  Top 0.508: 58.18,33.8 v58.17,33.78 | J3.GND 75.44,6 v75.44,6.35
  pour Bottom: -1.02,71.63 -1.02,-1.02 -0.76,-1.02 99.57,-1.02 99.57,0.51 99.57,71.88 99.31,71.88 99.31,71.63
N$2
  Top 0.152: RN3.2 48.62,25.53 48.62,25.68 48.16,26.14 46.41,26.14 43.66,23.39 L.A
N$3
  Top 0.152: RN3.8 47.85,26.9 48.08,27.13 48.08,27.2 48.31,27.43 50.75,27.43 51.66,26.52 51.66,23.62 50.14,22.1 ON.A
N$6
  Bottom 0.152: Q2.P$1 28.42,41.83 32,41.83 33.53,40.31 33.91,40.31 33.98,40.23 35.2,40.23 IC4.1
N$7
  Bottom 0.152: IC4.2 33.6,41.53 30.1,45.03 28.42,45.03 Q2.P$4
N$8  (via drill 0.35)
  Top 0.152: v31.85,32.84 31.47,33.22 31.47,35.81 R5.1
  Bottom 0.152: v31.85,32.84 31.24,32.23 30.79,32.23 SJ3.1
N$9
  Bottom 0.152: SJ4.1 39.55,32.69 39.55,36.8 R6.2
N$10  (via drill 0.35)  (1 unrouted)
  Top 0.152: 45.03,40.31 45.03,39.93 C9.1 45.03,40.31 | 45.72,44.42 R7.2 | 45.03,40.31 v42.14,40.31
  Top 0.305: C9.1 45.02,40.45 45.72,41.15 45.72,43.69
  Bottom 0.152: v42.14,40.31 40.46,40.31 IC4.8
N$11
  Top 0.152: RN2.2 60.5,61.11 60.5,61.27 59.97,61.8 59.44,61.8 55.4,65.84 55.4,66.75 LCD1.15
N$22
  Top 0.152: R8.3 21.64,28.5 21.64,63.55 24.84,66.75 LCD1.3
PB1  (via drill 0.35)
  Top 0.152: v54.71,18.44 60.27,24 60.27,26.59 59.89,26.98 59.89,30.79 62.64,33.53 62.64,35.89 IC3.20 | v53.8,17.53 37.34,17.53 29.41,9.6 23.55,9.6 19.58,5.64 ICSP.3
  Bottom 0.152: v53.8,17.53 v54.71,18.44
PB2
  Top 0.152: IC3.21 63.17,35.97 63.17,36.73 62.87,37.03 52.5,37.03 46.56,31.09 35.2,31.09 18.06,13.95 18.06,5.03 19.51,3.58 19.51,3.05 ICSP.4
PB3  (via drill 0.35)
  Top 0.152: v55.63,18.44 60.58,23.39 60.58,26.75 60.2,27.13 60.2,30.63 63.63,34.06 63.63,35.89 IC3.22 | v53.11,16.92 37.19,16.92 29.57,9.3 25.76,9.3 22.1,5.64 ICSP.1
  Bottom 0.152: v55.63,18.44 54.1,16.92 v53.11,16.92
PB7  (via drill 0.35)
  Top 0.152: v51.05,26.21 49.07,26.21 48.69,26.59 48.69,26.82 RN3.7 | v60.81,30.33 67.13,36.65 67.13,37.87 IC3.26
  Bottom 0.152: v51.05,26.21 56.69,26.21 v60.81,30.33
PC0
  Top 0.152: IC3.53 64.16,51.97 64.16,55.47 52.88,66.75 LCD1.14
PC1
  Top 0.152: IC3.54 63.63,51.97 63.63,53.49 50.37,66.75 LCD1.13
PC2
  Top 0.152: IC3.55 63.17,51.97 63.17,52.73 50.29,65.61 48.92,65.61 47.78,66.75 LCD1.12
PC3
  Top 0.152: IC3.56 62.64,51.97 62.64,52.73 50.06,65.3 46.71,65.3 45.26,66.75 LCD1.11
PC4
  Top 0.152: IC3.57 62.18,51.97 62.18,52.73 49.91,65 34.29,65 32.54,66.75 LCD1.6
PC5
  Top 0.152: IC3.58 61.65,51.97 61.65,52.73 49.68,64.69 29.57,64.69 27.51,66.75 LCD1.4
PD4
  Top 0.152: IC3.47 67.21,48.39 67.97,48.39 88.7,27.66 88.7,24.38 90.68,22.4 TESTPIN.5
PD5
  Top 0.152: IC3.48 67.21,48.92 67.97,48.92 89,27.89 89,26.59 90.68,24.92 TESTPIN.6
PD6
  Top 0.152: TESTPIN.7 68.73,49.38 67.21,49.38 IC3.49
PD7
  Top 0.152: IC3.50 67.21,49.91 70.79,49.91 90.68,30.02 TESTPIN.8 90.68,30.1 95.1,34.52 95.71,34.52 J1.5
PISCL  (via drill 0.35)
  Top 0.152: v38.79,42.44 36.35,42.44 29.72,35.81 R5.2 29.49,35.81 29.49,33.15 7.16,10.82 7.16,9.91 PIHEADER.5
  Bottom 0.152: v38.79,42.44 39.17,42.82 40.39,42.82 IC4.6
PISDA  (via drill 0.35)
  Top 0.152: v36.5,36.35 32.38,32.23 31.32,32.23 7.16,8.08 7.16,7.39 PIHEADER.3
  Bottom 0.152: IC4.5 40.39,44.04 39.17,44.04 37.72,42.6 37.72,36.88 R6.1 37.64,36.8 37.34,36.5 36.65,36.5 v36.5,36.35
PL3
  Top 0.152: IC3.38 67.21,43.89 67.97,43.89 76.28,35.59 76.28,27.81 78.18,25.91 M1.1
PWRIN  (via drill 0.41)
  Top 0.508: J3.VBUS 71.85,6.32 v72.39,6.86 | v74.93,8.38 73.57,9.74 D1.A
  Bottom 0.508: v72.39,6.86 73.41,6.86 v74.93,8.38
RESET  (via drill 0.35)
  Top 0.152: ICSP.5 17.07,5.56 18.14,4.5 18.14,3.05 19.2,1.98 19.96,1.98 20.57,2.59 20.57,3.05 21.64,4.12 22.1,4.12 26.98,8.99 28.65,8.99 28.8,8.84 28.8,6.1 29.74,5.16 30.73,5.16 31.62,6.04 | RN5.1 54.33,29.87 54.33,29.49 55.47,28.35 55.47,21.79 54.63,20.95 C1.1 54.56,20.95 52.88,19.28 v51.89,19.28 | IC3.30 67.21,39.93 67.97,39.93 68.2,39.7 68.2,35.59 63.86,31.24 63.86,26.52 65.53,24.84 RESET.3 65.61,24.77 65.61,16.54 | 65.61,16.54 65.61,16.38 RESET.4 65.61,16.54 | 65.61,16.54 56.01,16.54 55.78,16.31 v51.89,16.31 39.09,16.31 31.62,8.84 31.62,6.04 | POWER.3 35.56,4.32 35.56,5.84 35.36,6.04 31.62,6.04
  Bottom 0.152: v51.89,19.28 51.51,18.9 51.51,17.83 D3.A 51.51,17.75 51.51,16.69 v51.89,16.31
RXD0  (via drill 0.35)
  Top 0.152: v19.96,14.02 21.57,14.02 31.77,24.23 43.59,24.23 48.16,28.8 48.16,29.41 53.65,34.9 53.65,35.89 IC3.2
  Bottom 0.152: v19.96,14.02 17.22,11.28 8.23,11.28 8,11.51 7.85,11.51 7.62,11.28 5.71,11.28 4.57,12.42 PIHEADER.8
RXD1
  Top 0.152: TESTPIN.4 88.39,22.1 88.39,26.98 67.97,47.4 67.21,47.4 IC3.45
SCL
  Top 0.152: IC3.43 67.21,46.41 67.97,46.41 76.58,37.8 76.58,31.93 76.96,31.55 77.5,31.55 78.03,31.01 78.03,30.86 RN1.2 78.11,30.79 78.11,30.63 79.48,29.26 79.48,20.88 88.16,12.19 TESTPIN.1 90.68,12.65
SDA
  Top 0.152: IC3.44 67.21,46.94 67.97,46.94 80.24,34.67 80.24,31.77 80.01,31.55 79.48,31.55 78.94,31.01 78.94,30.86 RN1.3 78.94,30.79 78.94,30.63 79.78,29.79 79.78,21.03 86.08,14.73 TESTPIN.2 90.68,14.25
TXD0
  Top 0.152: R3.1 57.76,26.21 57.76,31.62 54.25,35.13 54.25,35.89 IC3.3
TXD1
  Top 0.152: IC3.46 67.13,48.01 66.37,48.01 66.14,48.23 66.14,50.14 66.37,50.37 80.54,50.37 95.48,35.43 96.85,35.43 97.38,34.9 97.38,24 90.68,17.3 TESTPIN.3
TXD2  (via drill 0.35)
  Top 0.152: IC3.13 59.21,35.89 59.21,35.13 59.51,34.82 59.51,26.21 R3.2 59.51,26.14 59.51,24.69 54.1,19.28 54.1,18.14 | R2.2 59.74,15.24 58.9,16.08 56.46,16.08 v56.31,15.93 | 54.1,18.14 v55.32,16.92 | v18.67,13.64 19.43,13.64 19.66,13.41 26.52,13.41 31.24,18.14 54.1,18.14
  Bottom 0.152: v55.32,16.92 v56.31,15.93 | v18.67,13.64 8.38,13.64 8.08,13.34 7.92,13.34 7.62,13.64 6.71,13.64 5.41,14.94 4.57,14.94 PIHEADER.10
VBAT1
  Bottom 0.152: IC4.3 35.28,42.82 36.96,42.82 38.56,44.42 38.56,49.3 41.99,52.73 41.99,53.57 B2.+$1
VIN
  Top 0.61: PC1.+ 80.85,11.73 74.83,11.73 72.62,13.95 D1.C 72.39,14.1 67.59,9.3 66.06,9.3 C2.1 65.91,8.99 63.93,7.01 63.93,6.78 63.55,6.4 53.87,6.4 53.8,6.48 51.97,6.48 49.04,3.55 POWER.8 45.03,7.54 40.13,7.54 39.62,7.54 32.54,7.54 IC1.3
XTAL1
  Top 0.152: R1.1 68.96,31.77 70.03,32.84 70.03,33.76 Y1.3 70.03,33.83 70.03,39.85 67.97,41.91 67.21,41.91 IC3.34
XTAL2
  Top 0.152: R1.2 67.21,30.79 67.21,32.92 68.05,33.76 Y1.1 68.12,33.83 68.12,34.59 68.5,34.98 68.5,40.92 68.05,41.38 67.21,41.38 IC3.33